# EAGLE schematic avr-module (EAGLE 9.6.2)
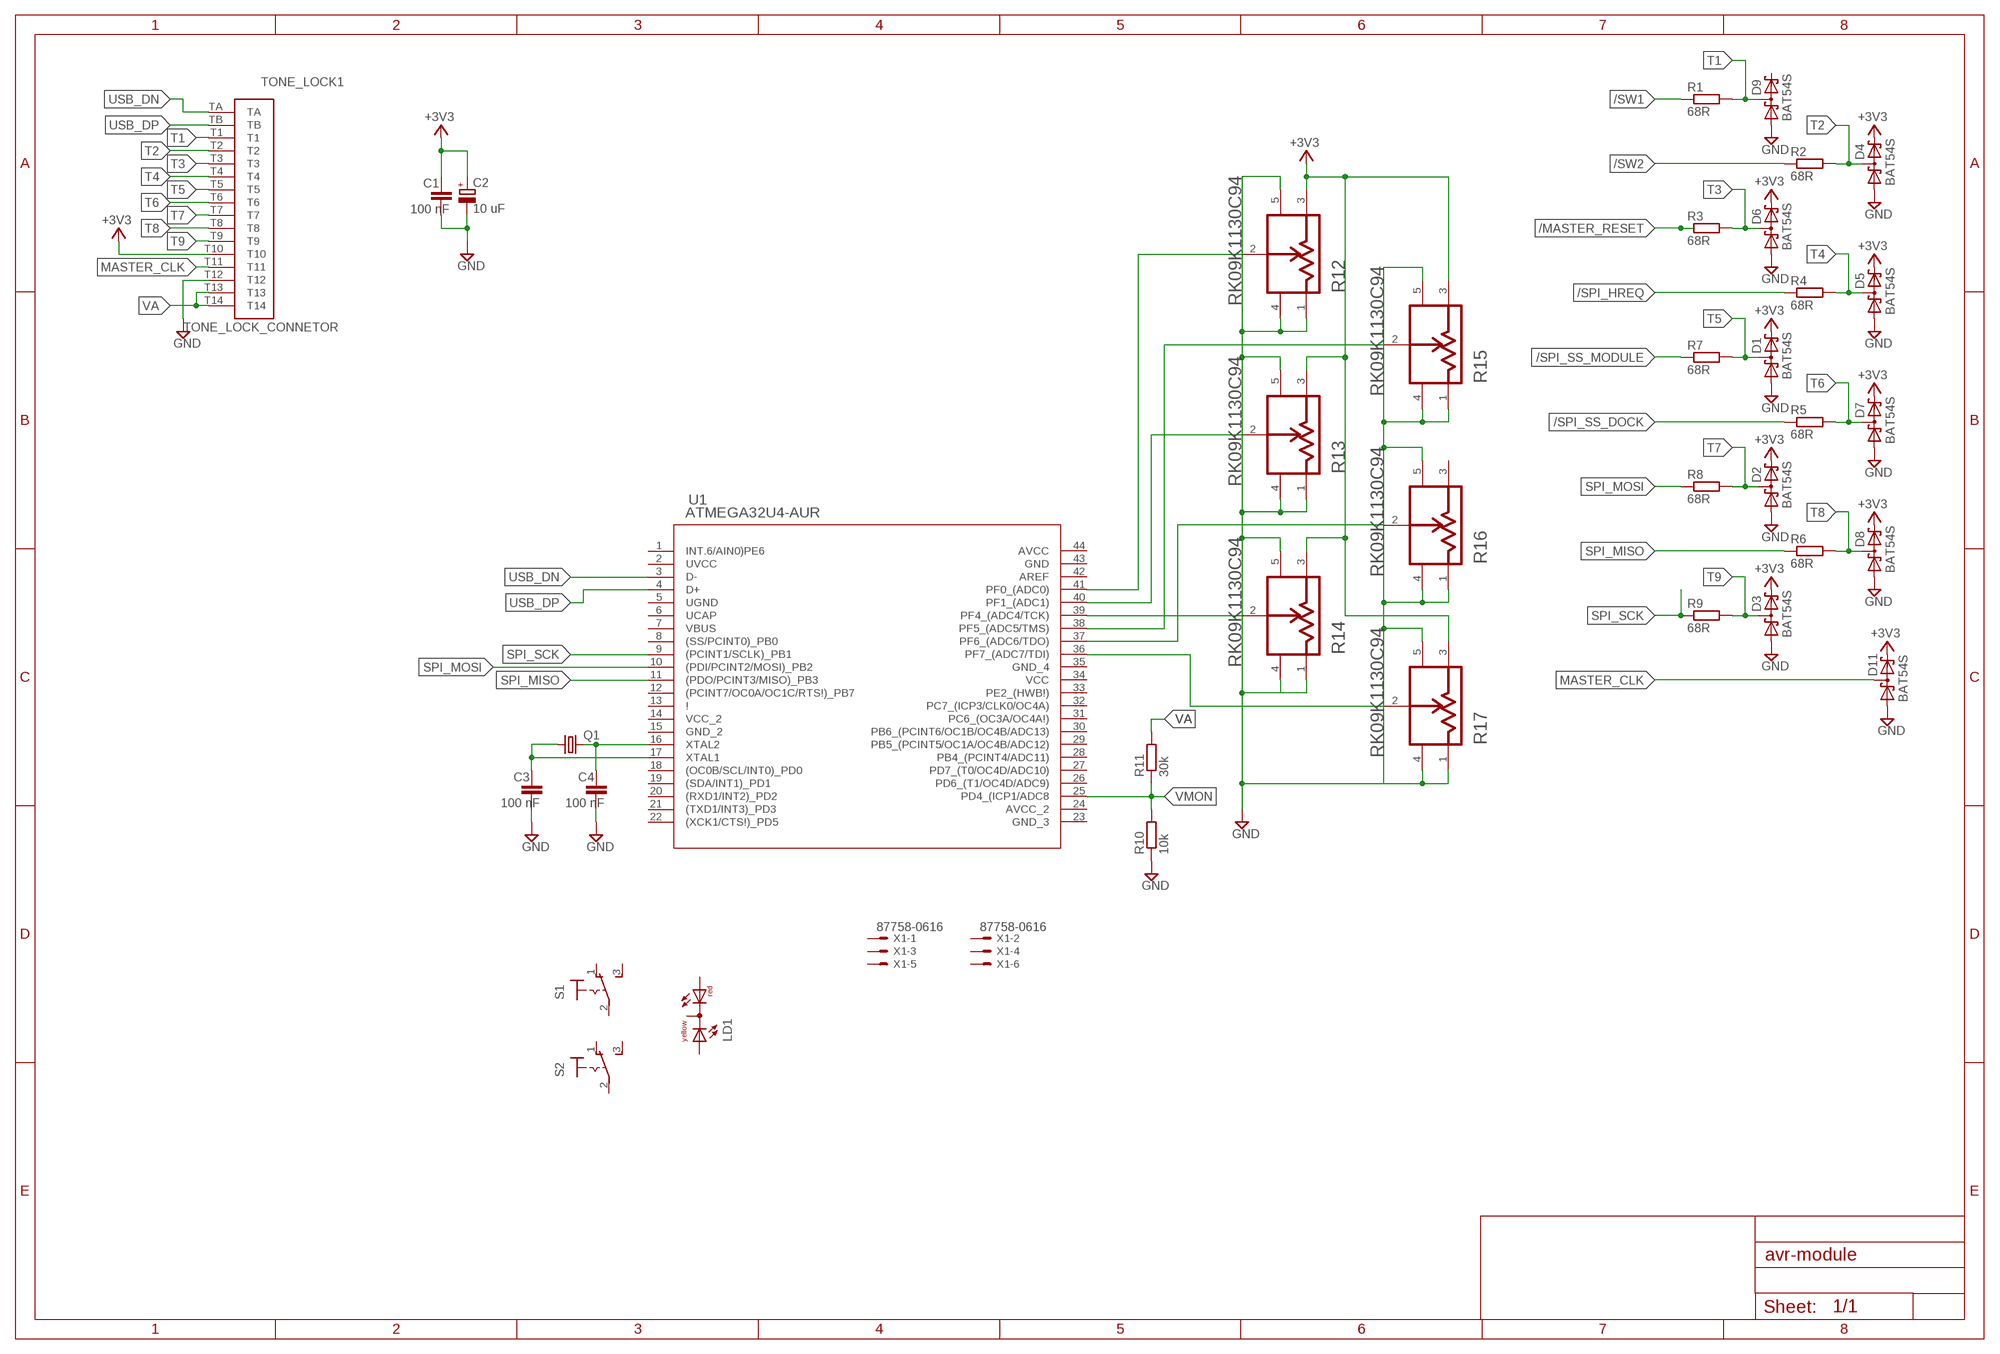
[diagram p0: schematic, sheet 1]

## Parts
C1  100 nF  C-EUC0805  [C0805]
C2  10 uF  CPOL-EUUD-4X5,8  [UD-4X5,8_NICHICON]
C3  100 nF  C-EUC0805  [C0805]
C4  100 nF  C-EUC0805  [C0805]
D1  BAT54S  [SOT23]
D2  BAT54S  [SOT23]
D3  BAT54S  [SOT23]
D4  BAT54S  [SOT23]
D5  BAT54S  [SOT23]
D6  BAT54S  [SOT23]
D7  BAT54S  [SOT23]
D8  BAT54S  [SOT23]
D9  BAT54S  [SOT23]
D11  BAT54S  [SOT23]
LD1  DUOLED-RY-C  [DUOLED-C-5MM]
Q1  CRYSTALHC49S  [HC49/S]
R1  68R  R-EU_M1206  [M1206]
R2  68R  R-EU_M1206  [M1206]
R3  68R  R-EU_M1206  [M1206]
R4  68R  R-EU_M1206  [M1206]
R5  68R  R-EU_M1206  [M1206]
R6  68R  R-EU_M1206  [M1206]
R7  68R  R-EU_M1206  [M1206]
R8  68R  R-EU_M1206  [M1206]
R9  68R  R-EU_M1206  [M1206]
R10  10k  R-EU_M1206  [M1206]
R11  30k  R-EU_M1206  [M1206]
R12  ALPS_ELECTRIC_CO.,_LTD._RK09K1130C94ALPS_ELECTRIC_CO.,_LTD._RK09K1130C94_0_0  [ALPS_ELECTRIC_CO.,_LTD._RK09K1130C94_0]
R13  ALPS_ELECTRIC_CO.,_LTD._RK09K1130C94ALPS_ELECTRIC_CO.,_LTD._RK09K1130C94_0_0  [ALPS_ELECTRIC_CO.,_LTD._RK09K1130C94_0]
R14  ALPS_ELECTRIC_CO.,_LTD._RK09K1130C94ALPS_ELECTRIC_CO.,_LTD._RK09K1130C94_0_0  [ALPS_ELECTRIC_CO.,_LTD._RK09K1130C94_0]
R15  ALPS_ELECTRIC_CO.,_LTD._RK09K1130C94ALPS_ELECTRIC_CO.,_LTD._RK09K1130C94_0_0  [ALPS_ELECTRIC_CO.,_LTD._RK09K1130C94_0]
R16  ALPS_ELECTRIC_CO.,_LTD._RK09K1130C94ALPS_ELECTRIC_CO.,_LTD._RK09K1130C94_0_0  [ALPS_ELECTRIC_CO.,_LTD._RK09K1130C94_0]
R17  ALPS_ELECTRIC_CO.,_LTD._RK09K1130C94ALPS_ELECTRIC_CO.,_LTD._RK09K1130C94_0_0  [ALPS_ELECTRIC_CO.,_LTD._RK09K1130C94_0]
S1  320-916  [320-916]
S2  320-916  [320-916]
TONE_LOCK1  TONE_LOCK_CONNETOR  [TONE_LOCK_CONNECTOR]
U1  ATMEGA32U4-AUR  [44ML_ATM]
X1  87758-0616  [87758-0616]

## Nets
+3V3: C1.1 C2.+ D1.2(C2) D2.2(C2) D3.2(C2) D4.2(C2) D5.2(C2) D6.2(C2) D7.2(C2) D8.2(C2) D11.2(C2) R12.3 R13.3 R14.3 R15.3 R17.3 TONE_LOCK1.T10
/MASTER_RESET: R3.1
/SPI_HREQ: R4.1
/SPI_SS_DOCK: R5.1
/SPI_SS_MODULE: R7.1
/SW1: R1.1
/SW2: R2.1
GND: C1.2 C2.- C3.2 C4.2 D1.1(A1) D2.1(A1) D3.1(A1) D4.1(A1) D5.1(A1) D6.1(A1) D7.1(A1) D8.1(A1) D9.1(A1) D11.1(A1) R10.1 R12.1 R12.4(MT1) R12.5(MT2) R13.1 R13.4(MT1) R13.5(MT2) R14.1 R14.4(MT1) R14.5(MT2) R15.1 R15.4(MT1) R15.5(MT2) R16.1 R16.4(MT1) R16.5(MT2) R17.1 R17.4(MT1) R17.5(MT2) TONE_LOCK1.T12
MASTER_CLK: D11.3(C1A2) TONE_LOCK1.T11
N$1: R12.2 U1.41(PF0_(ADC0))
N$2: R13.2 U1.40(PF1_(ADC1))
N$3: R14.2 U1.39(PF4_(ADC4/TCK))
N$4: R15.2 U1.38(PF5_(ADC5/TMS))
N$5: R16.2 U1.37(PF6_(ADC6/TDO))
N$6: R17.2 U1.36(PF7_(ADC7/TDI))
N$7: U1.3(D-)
N$8: U1.4(D+)
N$9: C4.1 Q1.2 U1.16(XTAL2)
N$10: C3.1 Q1.1 U1.17(XTAL1)
SPI_MISO: R6.1 U1.11((PDO/PCINT3/MISO)_PB3)
SPI_MOSI: R8.1 U1.10((PDI/PCINT2/MOSI)_PB2)
SPI_SCK: R9.1 U1.9((PCINT1/SCLK)_PB1)
T1: D9.3(C1A2) R1.2 TONE_LOCK1.T1
T2: D4.3(C1A2) R2.2 TONE_LOCK1.T2
T3: D6.3(C1A2) R3.2 TONE_LOCK1.T3
T4: D5.3(C1A2) R4.2 TONE_LOCK1.T4
T5: D1.3(C1A2) R7.2 TONE_LOCK1.T5
T6: D7.3(C1A2) R5.2 TONE_LOCK1.T6
T7: D2.3(C1A2) R8.2 TONE_LOCK1.T7
T8: D8.3(C1A2) R6.2 TONE_LOCK1.T8
T9: D3.3(C1A2) R9.2 TONE_LOCK1.T9
USB_DN: TONE_LOCK1.TA
USB_DP: TONE_LOCK1.TB
VA: R11.2 TONE_LOCK1.T13 TONE_LOCK1.T14
VMON: R10.2 R11.1 U1.25(PD4_(ICP1/ADC8)
Unconnected: D9.2(C2) LD1.AR LD1.AX(AY) LD1.C R16.3 S1.1(O) S1.2(P) S1.3(S) S2.1(O) S2.2(P) S2.3(S) U1.1(INT.6/AIN0)PE6) U1.8((SS/PCINT0)_PB0) U1.12((PCINT7/OC0A/OC1C/RTS!)_PB7) U1.13(!) U1.18((OC0B/SCL/INT0)_PD0) U1.19((SDA/INT1)_PD1) U1.20((RXD1/INT2)_PD2) U1.21((TXD1/INT3)_PD3) U1.22((XCK1/CTS!)_PD5) U1.26(PD6_(T1/OC4D/ADC9)) U1.27(PD7_(T0/OC4D/ADC10)) U1.28(PB4_(PCINT4/ADC11)) U1.29(PB5_(PCINT5/OC1A/OC4B/ADC12)) U1.30(PB6_(PCINT6/OC1B/OC4B/ADC13)) U1.31(PC6_(OC3A/OC4A!)) U1.32(PC7_(ICP3/CLK0/OC4A)) U1.33(PE2_(HWB!)) U1.42(AREF) X1.1 X1.2 X1.3 X1.4 X1.5 X1.6

## Power pins joined to a net without a drawn wire
AVCC: U1.44(AVCC)
AVCC_2: U1.24(AVCC_2)
GND: U1.43(GND)
GND_2: U1.15(GND_2)
GND_3: U1.23(GND_3)
GND_4: U1.35(GND_4)
UCAP: U1.6(UCAP)
UGND: U1.5(UGND)
UVCC: U1.2(UVCC)
VBUS: U1.7(VBUS)
VCC: U1.34(VCC)
VCC_2: U1.14(VCC_2)

## Library data of the parts
C1 C3 C4 = rcl:C-EU: CAPACITOR, European symbol
C2 = rcl:CPOL-EU: POLARIZED CAPACITOR, European symbol
D1-D9 D11 = diode:BAT54S: Schottky Diodes Pin connection corrected 2011-05-04 Source: Fairchild .. BAT54.pdf
LD1 = led:DUOLED-RY-C: DUO LED 2 colors (red/yellow), 5 mm, round, common Cathode www.ligitek.com or other producers.
Q1 = crystal:CRYSTAL: CRYSTAL; OC_FARNELL: 1667008; OC_NEWARK: unknown
R1-R11 = rcl:R-EU_: RESISTOR, European symbol
R12-R17 = RK09K1130C94:ALPS_ELECTRIC_CO.,_LTD._RK09K1130C94: 100 KΩ Potentiometer, Vertical, Through Hole; DATASHEET: http://www.farnell.com/datasheets/1718712.pdf; IMPORTED_FROM: octopart; MF: ALPS Electric Co., Ltd.; MOUNTING_TYPE: through hole; MPN: RK09K1130C94; NUM_PINS: 3; OCTOPART_PART_NUMBER: 4145893953c29e82; POWER_RATING: 50 mW; PREFIX: R; REACH_SVHC_COMPLIANCE: No SVHC; RESISTANCE: 100kΩ; VOLTAGE_RATING_DC: 20 V
S1 S2 = switch:320-916: TOGGLE SWITCH distributor RS Components
TONE_LOCK1 = tcddk:TONE_LOCK_CONNETOR
U1 = tcddk:ATMEGA32U4-AUR; BUILT_BY: EMA_UL_Team; MANUFACTURER_PART_NUMBER: ATMEGA32U4-AUR; SOURCELIBRARY: Atmel_2014-06-19; VENDOR: Atmel
X1 = con-molex:87758-0616: 6 Pin - 2mm Dual Row Single Wafer, Vertical T/H HDR Source: http://www.molex.com/pdm_docs/sd/877580616_sd.pdf; MPN: 87758-0616; OC_FARNELL: 7472323; OC_NEWARK: 25M5667